# EAGLE design LO_synth_sma (EAGLE 9.5.2)

## Sheet 1 of 2
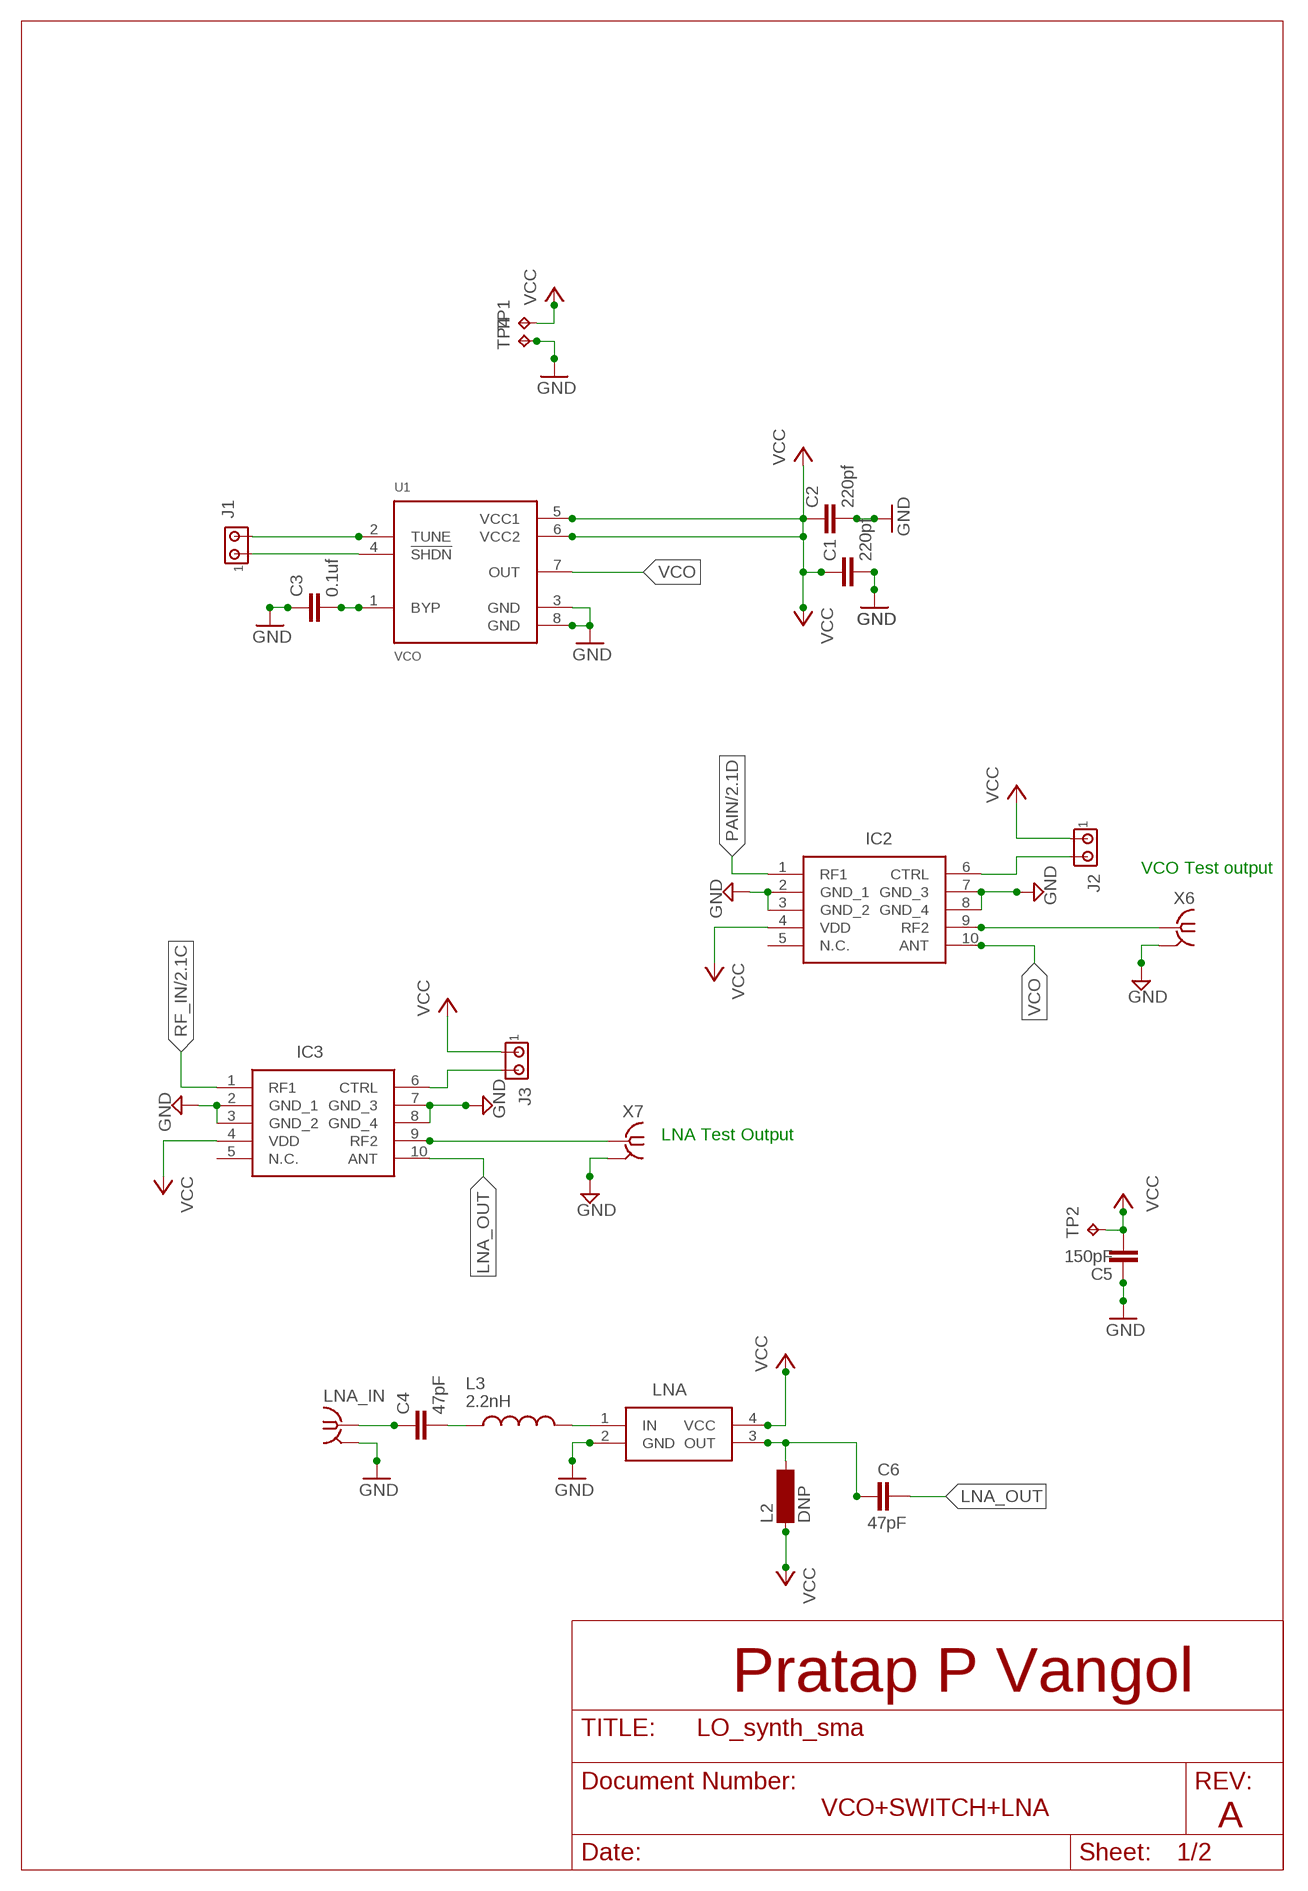
[diagram p0: schematic, sheet 1]

### Parts
C1  220pf  C-EUC0805  [C0805]
C2  220pf  C-EUC0805  [C0805]
C3  0.1uf  C-EUC0805  [C0805]
C4  47pF  C-EUC0805K  [C0805K]
C5  150pF  C-EUC0805K  [C0805K]
C6  47pF  C-EUC0805K  [C0805K]
IC2  BGS12PN10E6327XTSA1  [BGSA11GN10E6327XTSA1]
IC3  BGS12PN10E6327XTSA1  [BGSA11GN10E6327XTSA1]
J1  MTA02-100  [10X02MTA]
J2  MTA02-100  [10X02MTA]
J3  MTA02-100  [10X02MTA]
L2  DNP  MS85  [MS85]
L3  2.2nH  CE201210-2N2D  [INDC2012X103N]
LNA  BGA622H6820XTSA1  [BGA622H6820XTSA1]
LNA_IN  SMA-142-0711-821/826  [J502-ND-142-0711-821/826]
TP1  TPPAD1-13  [P1-13]
TP2  TPPAD1-13  [P1-13]
TP4  TPPAD1-13  [P1-13]
U1  VCO  MAX2750EUA+  [SOP65P490X110-8N]
X6  VCO Test  SMA-142-0711-821/826  [J502-ND-142-0711-821/826]
X7  SMA-142-0711-821/826  [J502-ND-142-0711-821/826]

### Nets
GND: C1.2 C2.2 C3.1 C5.1 IC2.2(GND_1) IC2.3(GND_2) IC2.7(GND_3) IC2.8(GND_4) IC3.2(GND_1) IC3.3(GND_2) IC3.7(GND_3) IC3.8(GND_4) LNA.2(GND) LNA_IN.G@1 LNA_IN.G@2 LNA_IN.G@3 LNA_IN.G@4 TP4.TP U1.3(GND) U1.8(GND) X6.G@1 X6.G@2 X6.G@3 X6.G@4 X7.G@1 X7.G@2 X7.G@3 X7.G@4 ; also sheet 2
LNA_OUT: C6.2 IC3.10(ANT)
N$1: C4.2 L3.1
N$2: C3.2 U1.1(BYP)
N$3: L3.2 LNA.1(IN)
N$4: J1.2 U1.2(TUNE)
N$5: J1.1 U1.4(!SHDN)
N$7: C4.1 LNA_IN.1
N$8: IC3.9(RF2) X7.1
N$9: C6.1 L2.2 LNA.3(OUT)
N$12: IC2.6(CTRL) J2.2
N$13: IC2.9(RF2) X6.1
N$17: IC3.6(CTRL) J3.2
PAIN: IC2.1(RF1) ; also sheet 2
RF_IN: IC3.1(RF1) ; also sheet 2
VCC: C1.1 C2.1 C5.2 IC2.4(VDD) IC3.4(VDD) J2.1 J3.1 L2.1 LNA.4(VCC) TP1.TP TP2.TP U1.5(VCC1) U1.6(VCC2) ; also sheet 2
VCO: IC2.10(ANT) U1.7(OUT)
Unconnected: IC2.5(N.C.) IC3.5(N.C.)

### Notes on the sheet
- VCO Test output
- LNA Test Output
- Pratap P Vangol
- VCO+SWITCH+LNA
- A

## Sheet 2 of 2
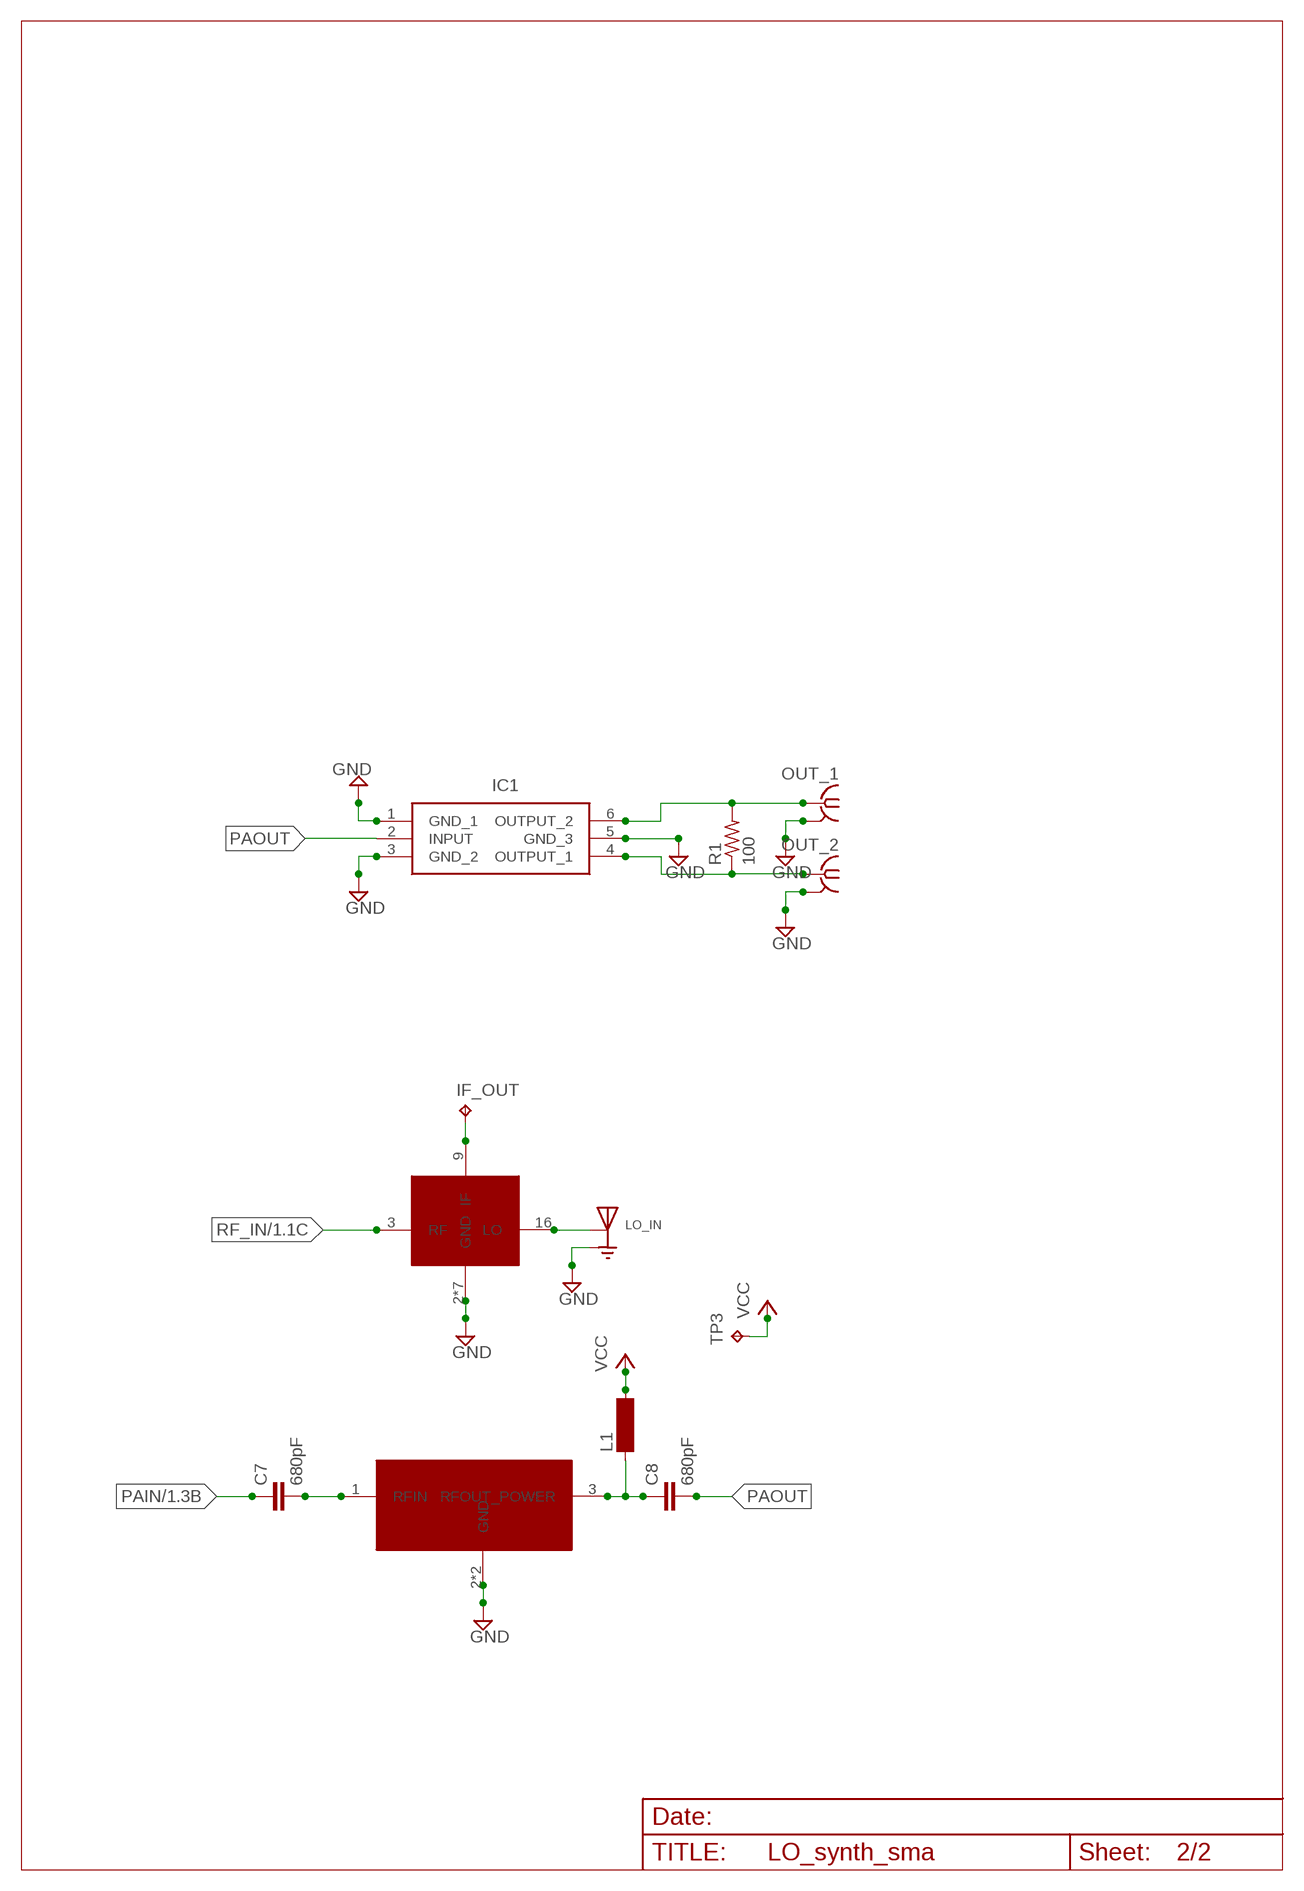
[diagram p1: schematic, sheet 2]

### Parts
C7  680pF  C-EUC0805K  [C0805K]
C8  680pF  C-EUC0805K  [C0805K]
IC1  PD2425J5050S2HF  [PD2425J5050S2HF]
IF_OUT  TPPAD1-13  [P1-13]
L1  MS85  [MS85]
LO_IN  U.FL-R-SMT-1(10)  [HRS_U.FL-R-SMT-1(10)]
OUT_1  SMA-142-0711-821/826  [J502-ND-142-0711-821/826]
OUT_2  SMA-142-0711-821/826  [J502-ND-142-0711-821/826]
R1  100  R-US_R0603  [R0603]
TP3  TPPAD1-13  [P1-13]
U$1  MDB-73H+QFN-24  [QFN24]
U$2  GVA-60+  [SOT89]

### Nets
GND: IC1.1(GND_1) IC1.3(GND_2) IC1.5(GND_3) LO_IN.1(GND) LO_IN.3(GND) OUT_1.G@1 OUT_1.G@2 OUT_1.G@3 OUT_1.G@4 OUT_2.G@1 OUT_2.G@2 OUT_2.G@3 OUT_2.G@4 U$1.2(GND) U$1.4(GND) U$1.8(GND) U$1.10(GND) U$1.15(GND) U$1.17(GND) U$1.PD(GND) U$2.2(GND) U$2.2@1(GND) ; also sheet 1
LO: LO_IN.2(SIG) U$1.16(LO)
N$6: IF_OUT.TP U$1.9(IF)
N$10: C7.2 U$2.1(RFIN)
N$11: C8.1 L1.1 U$2.3(RFOUT_POWER)
N$14: IC1.6(OUTPUT_2) OUT_1.1 R1.2
N$15: IC1.4(OUTPUT_1) OUT_2.1 R1.1
PAIN: C7.1 ; also sheet 1
PAOUT: C8.2 IC1.2(INPUT)
RF_IN: U$1.3(RF) ; also sheet 1
VCC: L1.2 TP3.TP ; also sheet 1

## Library data of the parts
C1-C8 = rcl:C-EU: CAPACITOR, European symbol; SPICEPREFIX: C
IC1 = PD2425J5050S2HF:PD2425J5050S2HF: Signal Conditioning 2.4-2.5GHz IL .4dB Mini Wilkinson PD Source: Datasheet <https://cdn.anaren.com/product-documents/Xinger/PowerDividers/PD2425J5050S2HF/PD2425J5050S2HF_DataSheet(Rev_A).pdf>; DESCRIPTION: Signal Conditioning 2.4-2.5GHz IL .4dB Mini Wilkinson PD; HEIGHT: 0.58mm; MANUFACTURER_NAME: ANAREN; MANUFACTURER_PART_NUMBER: PD2425J5050S2HF; MOUSER_PART_NUMBER: 620-PD2425J5050S2HF; MOUSER_PRICE-STOCK: https://www.mouser.co.uk/ProductDetail/Anaren/PD2425J5050S2HF?qs=a9pbqwWPedVRUEtQ0k6YTg%3D%3D
IC2 IC3 = BGS12PN10E6327XTSA1:BGS12PN10E6327XTSA1: INFINEON - BGS12PN10E6327XTSA1 - RF SWITCH, 6GHZ, SPDT, TSNP-10 Source: Datasheet <https://www.infineon.com/dgdl/Infineon-BGS12PN10-DS-v01_00-EN.pdf?fileId=5546d46256fb43b30157565d296541b1>; DESCRIPTION: INFINEON - BGS12PN10E6327XTSA1 - RF SWITCH, 6GHZ, SPDT, TSNP-10; HEIGHT: 0.4mm; MANUFACTURER_NAME: Infineon; MANUFACTURER_PART_NUMBER: BGS12PN10E6327XTSA1; MOUSER_PART_NUMBER: 726-BGS12PN10E6327XT; MOUSER_PRICE-STOCK: https://www.mouser.co.uk/ProductDetail/Infineon-Technologies/BGS12PN10E6327XTSA1?qs=Qyx3PVvfm64AuqRtKq1hZw%3D%3D
IF_OUT TP1-TP4 = testpad:TP: Test pad
J1 = con-amp:MTA02-100: AMP connector
J2 J3 = con-amp:MTA02-100: AMP connector; SPICEPREFIX: B
L1 L2 = inductor-neosid:MS85: INDUCTOR SMD power inductor; OC_FARNELL: unknown; OC_NEWARK: unknown
L3 = CE201210-2N2D:CE201210-2N2D: FIXED IND 2.2NH 300MA 100 MOHM; AVAILABILITY: Unavailable; DESCRIPTION: 2.2nH Unshielded Multilayer Inductor 300mA 100mOhm Max 0805 _2012 Metric_; MF: Bourns; MP: CE201210-2N2D; PACKAGE: 2012 Bourns; PRICE: None
LNA = BGA622H6820XTSA1:BGA622H6820XTSA1: BGA622 Silicon Germanium Wide Band Low Noise Amplifier with 2 kV ESD Protection Source: Datasheet <https://componentsearchengine.com/Datasheets/1/BGA622H6820XTSA1.pdf>; DESCRIPTION: BGA622 Silicon Germanium Wide Band Low Noise Amplifier with 2 kV ESD Protection; HEIGHT: 0.9mm; MANUFACTURER_NAME: Infineon; MANUFACTURER_PART_NUMBER: BGA622H6820XTSA1; MOUSER_PART_NUMBER: 726-BGA622H6820XTSA1; MOUSER_PRICE-STOCK: https://www.mouser.com/Search/Refine.aspx?Keyword=726-BGA622H6820XTSA1
LNA_IN OUT_1 OUT_2 X6 X7 = con-coax:SMA-: SMA 50 Ohm End Launch Jack Receptacle - Round Contact Johnson Components Source: www.johnsoncomponents.com .. J502-ND.pdf; MF: JOHNSON COMPONENTS; MPN: 142-0711-821; OC_FARNELL: 1019328; OC_NEWARK: 16F3627
LO_IN = U.FL-R-SMT-1_10_:U.FL-R-SMT-1(10): U.FL Series 6 Ghz 50 Ohm Ultra-small SMT Coaxial Cable Receptacle; AVAILABILITY: Unavailable; DESCRIPTION: U.FL _UMCC_ Connector Receptacle, Male Pin 50Ohm Surface Mount Solder; MF: Hirose; MP: U.FL-R-SMT-1_10_; PACKAGE: None; PRICE: None
R1 = rcl:R-US_: RESISTOR, American symbol; SPICEPREFIX: R
U1 = MAX2750EUA_:MAX2750EUA+: Controlled Oscillator 2.4GHz to 2.5GHz VCXO 8-Pin uMAX; AVAILABILITY: Unavailable; DESCRIPTION: RF IC VCO ISM 2.4GHz ~ 2.5GHz On-Chip Tank Circuit 8-uMAX; MF: Maxim Integrated; MP: MAX2750EUA+; PACKAGE: &amp;MICRO;MAX-8 Maxim; PRICE: None
U$1 = MDB-73H+:MDB-73H+
U$2 = GVA-60+:GVA-60+: MiniCircuits GVA-60+ SiGE Power Amplifier

## Board
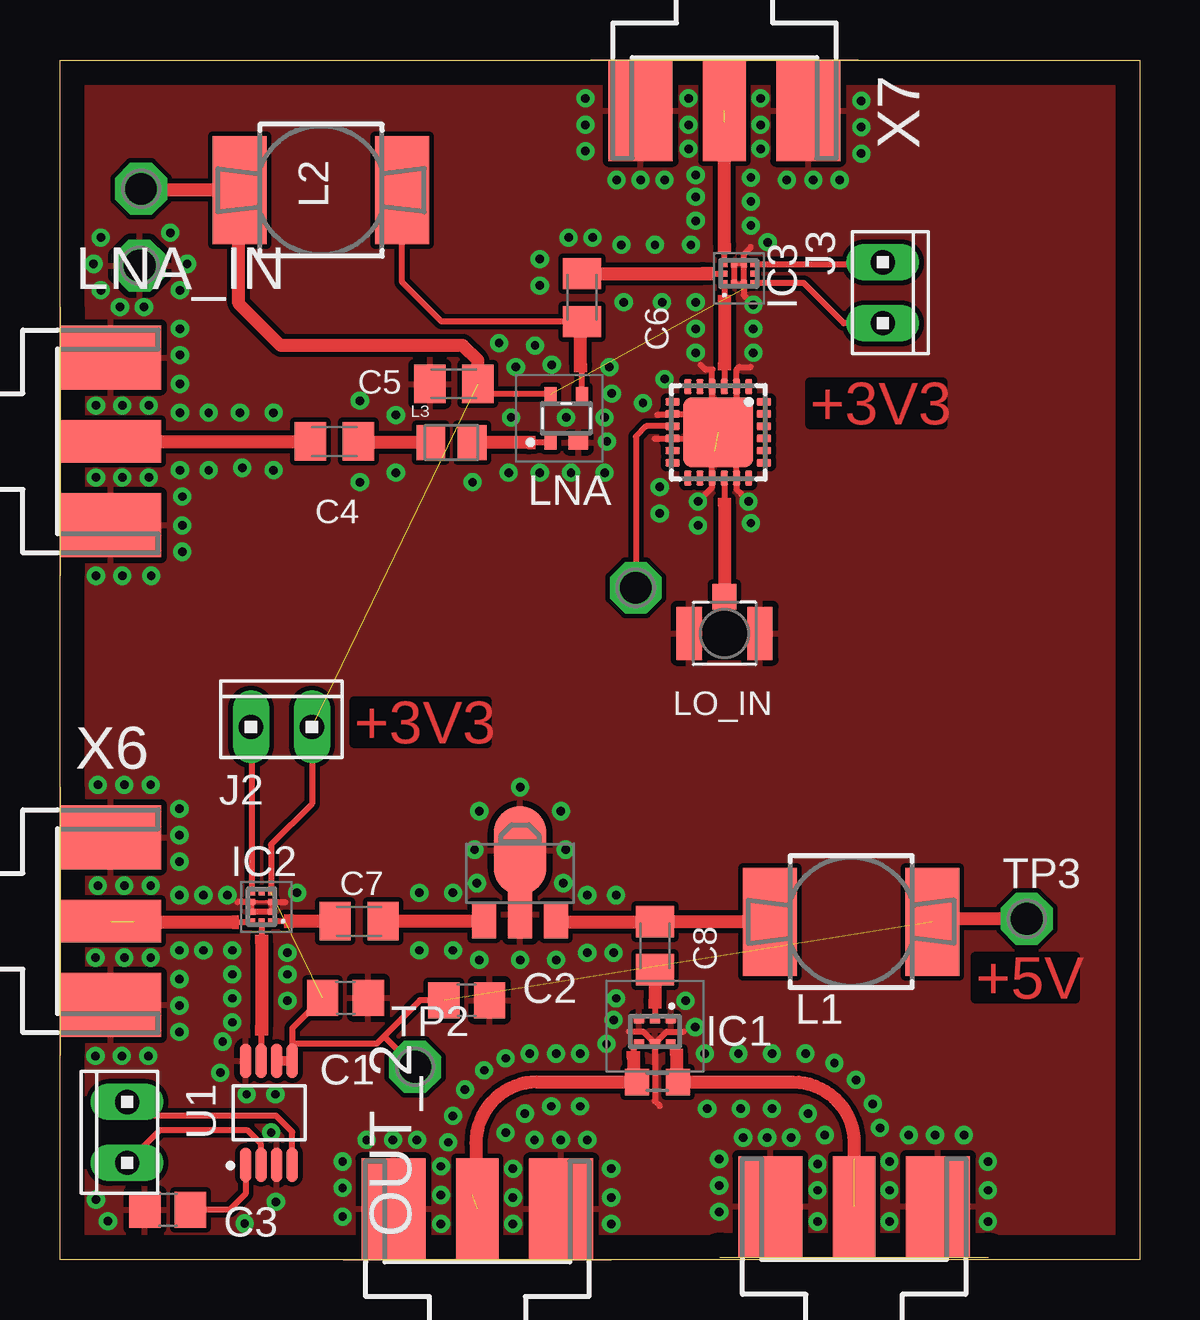
[diagram p2: board, top side]
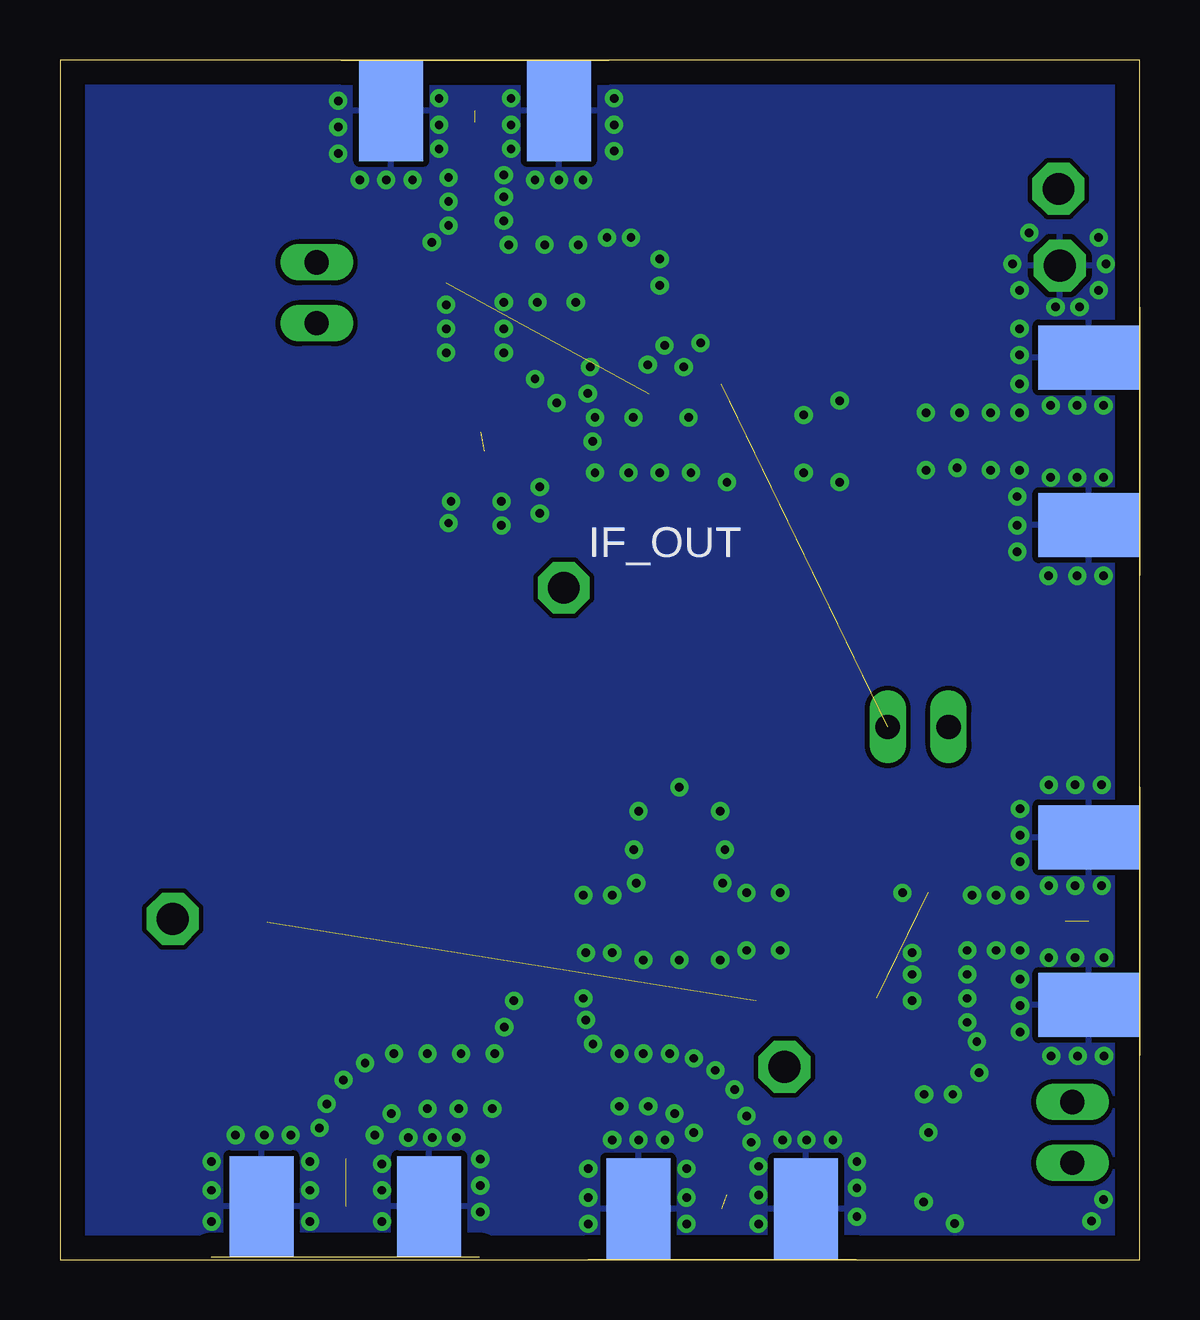
[diagram p3: board, bottom side, seen from below]

Size 45 x 50 mm. Coordinates in mm from the lower left corner, seen from the top.
Outline: 0,0 0,50 45,50 45,0 0,0
Copper layers (1*16): Top 0.035mm / dielectric 1.5mm / Bottom 0.035mm
Design rules "default *": minimum track width 6mil, minimum drill 0.35mm, track to track 0.2mm, track to pad 0.2mm, pad to pad 6mil, via to via 6mil, smd to smd 6mil, copper to edge 40mil, drill to drill 6mil, minimum pad ring 10mil, minimum via ring 8mil, stop-mask expansion 4mil, vias tented up to drill 0mil, thermal gap 10mil

### Footprints (pad centres in the part's own frame; a part is rotated, then mirrored left to right if it is on the bottom)
C0805 = smd 1.3 x 1.5: 1 -0.95,0; 2 0.95,0
C0805K = smd 1.3 x 1.6: 1 -1,0; 2 1,0
PD2425J5050S2HF = smd 0.41 x 0.33: 1 -0.66,-0.495; 2 0,-0.495; 3 0.66,-0.495; 4 0.66,0.495; 5 0,0.495; 6 -0.66,0.495
BGSA11GN10E6327XTSA1 = smd 0.25 x 0.25: 1 -0.4,0.6; 2 -0.4,0.2; 3 -0.4,-0.2; 4 -0.4,-0.6; 5 0,-0.6; 6 0.4,-0.6; 7 0.4,-0.2; 8 0.4,0.2; 9 0.4,0.6; 10 0,0.6
P1-13 = drill 1.321 pad 2.159 octagon: TP 0,0
10X02MTA = drill 1.016 long: 1 1.27,0; 2 -1.27,0
MS85 = smd 4.5 x 2.25: 1 0,-3.383; 2 0,3.383
INDC2012X103N = smd 1.2 x 1.47: 1 -0.86,0; 2 0.86,0
BGA622H6820XTSA1 = smd 0.5 x 0.58: 1 -0.65,-1.01; 3 0.65,1.01; 4 -0.65,1.01 | smd 0.8 x 0.58: 2 0.5,-1.01
J502-ND-142-0711-821/826 = smd 4.191 x 1.778: 1 2.115,0 | smd 4.191 x 2.667: G@1 2.115,3.495; G@2 2.115,-3.495 | smd 4.191 x 2.667 bottom: G@3 2.115,3.495; G@4 2.115,-3.495
HRS_U.FL-R-SMT-1(10) = smd 1.05 x 2.2: 1 -1.475,0; 3 1.475,0 | smd 1 x 1.05: 2 0,-1.525
R0603 = smd 1 x 1.1: 1 -0.85,0; 2 0.85,0
SOP65P490X110-8N = smd 1.42 x 0.47: 1 -2.165,0.975; 2 -2.165,0.325; 3 -2.165,-0.325; 4 -2.165,-0.975; 5 2.165,-0.975; 6 2.165,-0.325; 7 2.165,0.325; 8 2.165,0.975
QFN24 = smd 0.6 x 0.3: 1 -1.905,1.27; 2 -1.905,0.762; 3 -1.905,0.254; 4 -1.905,-0.254; 5 -1.905,-0.762; 6 -1.905,-1.27; 13 1.905,-1.27; 14 1.905,-0.762; 15 1.905,-0.254; 16 1.905,0.254; 17 1.905,0.762; 18 1.905,1.27 | smd 0.3 x 0.6: 7 -1.27,-1.905; 8 -0.762,-1.905; 9 -0.254,-1.905; 10 0.254,-1.905; 11 0.762,-1.905; 12 1.27,-1.905; 19 1.27,1.905; 20 0.762,1.905; 21 0.254,1.905; 22 -0.254,1.905; 23 -0.762,1.905; 24 -1.27,1.905 | smd 2.9 x 2.9: PD 0,0
SOT89 = smd 1 x 1.5: 1 -1.499,-1.981; 3 1.499,-1.981 | smd 1 x 2: 2 0,-1.727 | smd 2.2 x 3.7: 2@1 0,0.94

### Placement (x,y rotation side)
C1  11.9,10.91 0 top
C2  16.95,10.81 0 top
C3  4.49,2.07 0 top
C4  11.44,34.1 0 top
C5  16.42,36.5 0 top
C6  21.76,40.1 90 top
C7  12.47,14.1 0 top
C8  24.8,13.08 270 top
IC1  24.8,9.51 180 top
IC2  8.4,14.7 180 top
IC3  28.3,41.1 90 top
IF_OUT  24,28 0 top
J1  2.8,5.3 90 top
J2  9.23,22.2 0 top
J3  34.3,40.3 270 top
L1  32.98,14.08 270 top
L2  10.88,44.57 270 top
L3  16.32,34.05 0 top
LNA  21.11,35.06 0 top
LNA_IN  0,34.1 0 top
LO_IN  27.7,26.1 180 top
OUT_1  33.1,0.1 90 top
OUT_2  17.4,0 90 top
R1  24.9,7.4 0 top
TP1  3.38,44.63 0 top
TP2  14.8,8.03 0 top
TP3  40.3,14.2 0 top
TP4  3.32,41.43 0 top
U1  8.71,6.11 90 top
U$1  27.44,34.48 270 top
U$2  19.18,16.11 0 top
X6  0,14.1 0 top
X7  27.7,50 270 top

### Tracks (layer width: path | path; a pad name or v marks a point on that pad's centre or on a via)
GND  (via drill 0.35)  (1 unrouted)
  Top 0.152: IC2.2 IC2.3 IC2.7 IC2.8 | IC3.8 IC3.7 | IC3.2 IC3.3
  Top 0.254: IC2.7 7.4,14.9 | IC2.3 9.4,14.9 | IC2.2 IC2.8 | 28.6,40.1 28.5,40.2 IC3.3 IC3.7 28.5,41.9 28.8,42.2 | IC3.8 IC3.2 | 27.19,37.09 U$1.4 27.19,35.71 27.2,35.7 | 27.2,37.1 27.19,37.09 | 28.2,37.1 U$1.2 28.2,35.7 | 28.2,37.1 | 24.9,35.2 25.49,35.2 U$1.8 26.56,35.24 26.6,35.2 | 24.8,34.2 25.51,34.2 U$1.10 26.37,34.23 26.4,34.2 | U$1.15 | U$1.15 27.19,33.59 27.3,33.7 | 28.3,33.6 28.2,33.5 U$1.17 28.2,32.1 28.4,31.9 | U$1.15 27.19,32.19 26.8,31.8 | IC1.5 25.29,9.5 26,9.5 | IC1.5 24.32,9.5 23.7,9.5 | IC1.5 24.8,6.6 25,6.4 | 28.2,37.1 28.3,37.2 28.8,37.2 | 27.19,37.09 26.91,37.09 26.7,37.3
  other vias: 1.5,2.5 2,1.6 7.7,1.5 9,2.4 8.8,5.3 1.4,41.5 1.7,42.6 4.6,42.8 5.3,41.5 5,40.4 1.7,40.4 6.2,35.3 6.2,32.9 8.9,35.3 8.9,32.9 14,35.2 14,32.8 18.8,35.1 21.1,35.1 18.7,32.8 20.5,37.3 22.9,37.2 19,37.2 23.5,39.9 26.5,39.9 26.5,38.8 26.5,37.8 5.98,12.88 7.18,12.88 7.18,11.88 7.18,10.88 7.18,9.88 6.68,7.78 6.78,9.08 7.78,6.88 9.48,10.78 9.48,11.88 9.48,12.78 5.98,15.18 6.98,15.18 9.88,15.28 14.98,15.28 14.98,12.88 16.38,15.28 16.38,12.88 17.38,15.68 17.48,12.48 19.18,12.48 20.68,12.48 21.98,12.78 23.08,12.78 23.18,10.88 23.08,9.98 26.08,10.78 22.78,8.98 26.48,9.68 26.88,8.58 21.68,8.58 20.68,8.58 19.58,8.58 18.58,8.38 17.68,7.88 16.88,7.08 16.38,5.98 19.38,6.08 8.98,6.88 28.28,8.58 28.38,6.28 26.98,6.28 29.68,8.58 29.68,6.28 31.18,6.08 31.08,8.58 32.28,8.18 33.18,7.48 33.88,6.48 23,36.1 22.7,35.1 7.5,35.3 7.6,33 25.1,39.9 23.4,42.3 24.8,42.3 26.3,42.3 26.5,43.3 28.8,43.1 29.5,42.4 28.9,39.8 28.9,38.8 28.9,37.8 18.3,38.2 19.8,38.1 23.18,15.18 21.98,15.18 20,32.8 21.3,32.8 22.7,32.8 22.8,34.1 17.2,32.4 12.5,32.4 12.5,35.8 20,41.7 20,40.6 21.2,42.6 22.2,42.6 24.3,35.7 25.2,36.7 25,32.2 25,31.1 20.98,15.68 17.28,17.08 21.08,17.08 17.48,18.68 20.88,18.68 19.18,19.68 26.5,44.3 28.8,44.1 28.8,45.1 26.5,45.2 26.2,46.3 26.2,47.3 26.2,48.4 29.2,48.4 29.2,47.3 29.2,46.3 25.2,45 24.2,45 23.2,45 30.3,45 31.4,45 32.5,45 33.4,48.3 33.4,47.2 33.4,46.1 21.9,48.4 21.9,47.3 21.9,46.2 4.98,15.18 4.98,12.88 3.78,15.58 2.68,15.58 1.58,15.58 3.78,12.58 2.68,12.58 1.48,12.58 4.98,11.68 4.98,10.58 4.98,9.48 1.48,8.48 2.58,8.48 3.68,8.48 4.98,18.78 4.98,17.68 4.98,16.58 1.58,19.78 2.68,19.78 3.78,19.78 2.5,39.7 3.5,39.7 5,38.8 5,37.7 5,36.5 1.5,35.6 2.6,35.6 3.7,35.6 5,35.3 5,32.9 1.5,32.6 2.6,32.6 3.7,32.6 1.5,28.5 2.6,28.5 3.8,28.5 5.1,31.8 5.1,30.6 5.1,29.5 16.18,4.88 15.88,1.48 15.88,3.88 15.88,2.68 18.58,5.28 20.48,6.38 21.68,6.38 18.88,3.78 18.88,2.58 18.88,1.48 14.88,4.98 13.88,4.98 12.78,4.98 11.78,4.08 11.78,2.98 11.78,1.78 19.78,4.98 20.88,4.98 21.98,4.98 22.98,3.78 22.98,2.58 22.98,1.48 31.88,5.18 34.18,5.48 34.58,4.08 31.58,3.98 31.58,2.88 31.58,1.58 34.58,2.88 34.58,1.58 30.48,5.08 29.48,5.08 28.48,5.08 27.48,4.18 27.48,3.08 27.48,1.98 35.38,5.18 36.48,5.18 37.68,5.18 38.68,4.08 38.68,2.88 38.68,1.58 28.8,30.7 26.6,30.6 28.7,31.6 26.6,31.6
  pour Top: 0,50 45,50 45,0 0,0
  pour Bottom: 0,50 45,50 45,0 0,0
LNA_OUT
  Top 0.254: 26.8,41.1 IC3.10
  Top 0.55: C6.2 26.8,41.1
LO
  Top 0.254: 27.7,32.42 U$1.16 27.69,32.42 27.7,32.42 | 27.7,32.42 27.7,31.4
  Top 0.55: 27.7,31.4 LO_IN.2
N$1
  Top 0.55: L3.1 12.49,34.05 C4.2
N$2
  Top 0.254: U1.1 7.74,2.73 7.07,2.07 C3.2
N$3
  Top 0.254: LNA.1 19.55,34.05
  Top 0.55: 19.55,34.05 L3.2
N$4
  Top 0.254: U1.2 8.38,4.82 7.8,5.4 4.17,5.4 J1.2
N$5
  Top 0.254: U1.4 9.69,5.32 9,6 3.37,6 J1.1
N$6
  Top 0.254: U$1.9 24.43,34.73 24,34.3 IF_OUT.TP
N$7
  Top 0.55: C4.1 arc90 10.4,34.14 10.36,34.1 LNA_IN.1
N$8  (1 unrouted)
  Top 0.254: IC3.9 27.7,42.3
  Top 0.55: 27.7,42.3 27.7,47.41
N$9
  Top 0.254: LNA.3 21.76,37.24 arc90 21.7,37.3 | C6.1 15.9,39.1 14.26,40.74 L2.2
  Top 0.55: 21.7,37.3 21.7,39.04 arc-90 C6.1
N$10
  Top 0.55: U$2.1 17.65,14.1 C7.2
N$11
  Top 0.55: 24.78,14.1 C8.1 | U$2.3 20.73,14.08 C8.1 | L1.1 C8.1
N$12
  Top 0.254: IC2.6 8,22.16 J2.2
N$13  (1 unrouted)
  Top 0.254: IC2.9 7.96,14.06 7.16,14.06
  Top 0.55: 7.16,14.06 3.14,14.06 3.1,14.1
N$14  (1 unrouted)
  Top 0.254: IC1.6 25.7,8.78 25.7,8.5
  Top 0.55: 33.1,4.2 33.1,4.86 arc90 30.56,7.4 R1.2 25.7,7.45 25.7,8.5
N$15  (1 unrouted)
  Top 0.254: IC1.4 23.9,8.78 23.9,8.4
  Top 0.55: 23.9,8.4 23.9,7.55 R1.1 19.88,7.4 arc90 17.34,4.86 17.34,2.84 17.2,2.7
N$17
  Top 0.254: IC3.6 34.23,41.5 J3.2
PAIN
  Top 0.254: 9.7,14.1 IC2.1
  Top 0.55: C7.1 9.7,14.1
PAOUT
  Top 0.254: 24.8,10.8 IC1.2
  Top 0.55: C8.2 24.8,10.8
RF_IN
  Top 0.254: IC3.1 27.7,39.9 | 27.7,37.4 U$1.3
  Top 0.55: 27.7,39.9 27.7,37.4
VCC  (4 unrouted)
  Top 0.254: C1.1 9.69,9.64 9.69,9 | 9.69,9 U1.5 | C2.1 15.01,10.81 13.45,9.25 | 9.69,9 13.2,9 13.45,9.25 | LNA.4 17.85,36.07 C5.2 | 7.45,44.52 L2.1 | TP2.TP 13.58,9.25 13.45,9.25 | J3.1 32.67,39.03 31,40.7 IC3.4 | J2.1 10.5,19 8.8,17.3 IC2.4
  Top 0.4: U1.6 U1.5
  Top 0.55: C5.2 17.42,37.48 16.8,38.1 9.2,38.1 7.45,39.85 7.45,44.52 | L2.1 3.44,44.57 TP1.TP | 36.53,14.25 L1.2 36.48,14.2 TP3.TP
VCO
  Top 0.254: IC2.10 8.4,13.2 | 8.4,9.7 U1.7
  Top 0.55: 8.4,13.2 8.4,9.7
(copper drawn outside any net)
  shapes: Top area x14

### Text on the board
Top: +3V3 | +3V3 | +5V